# EAGLE schematic astronaut_mainboard (EAGLE 7.5.0)
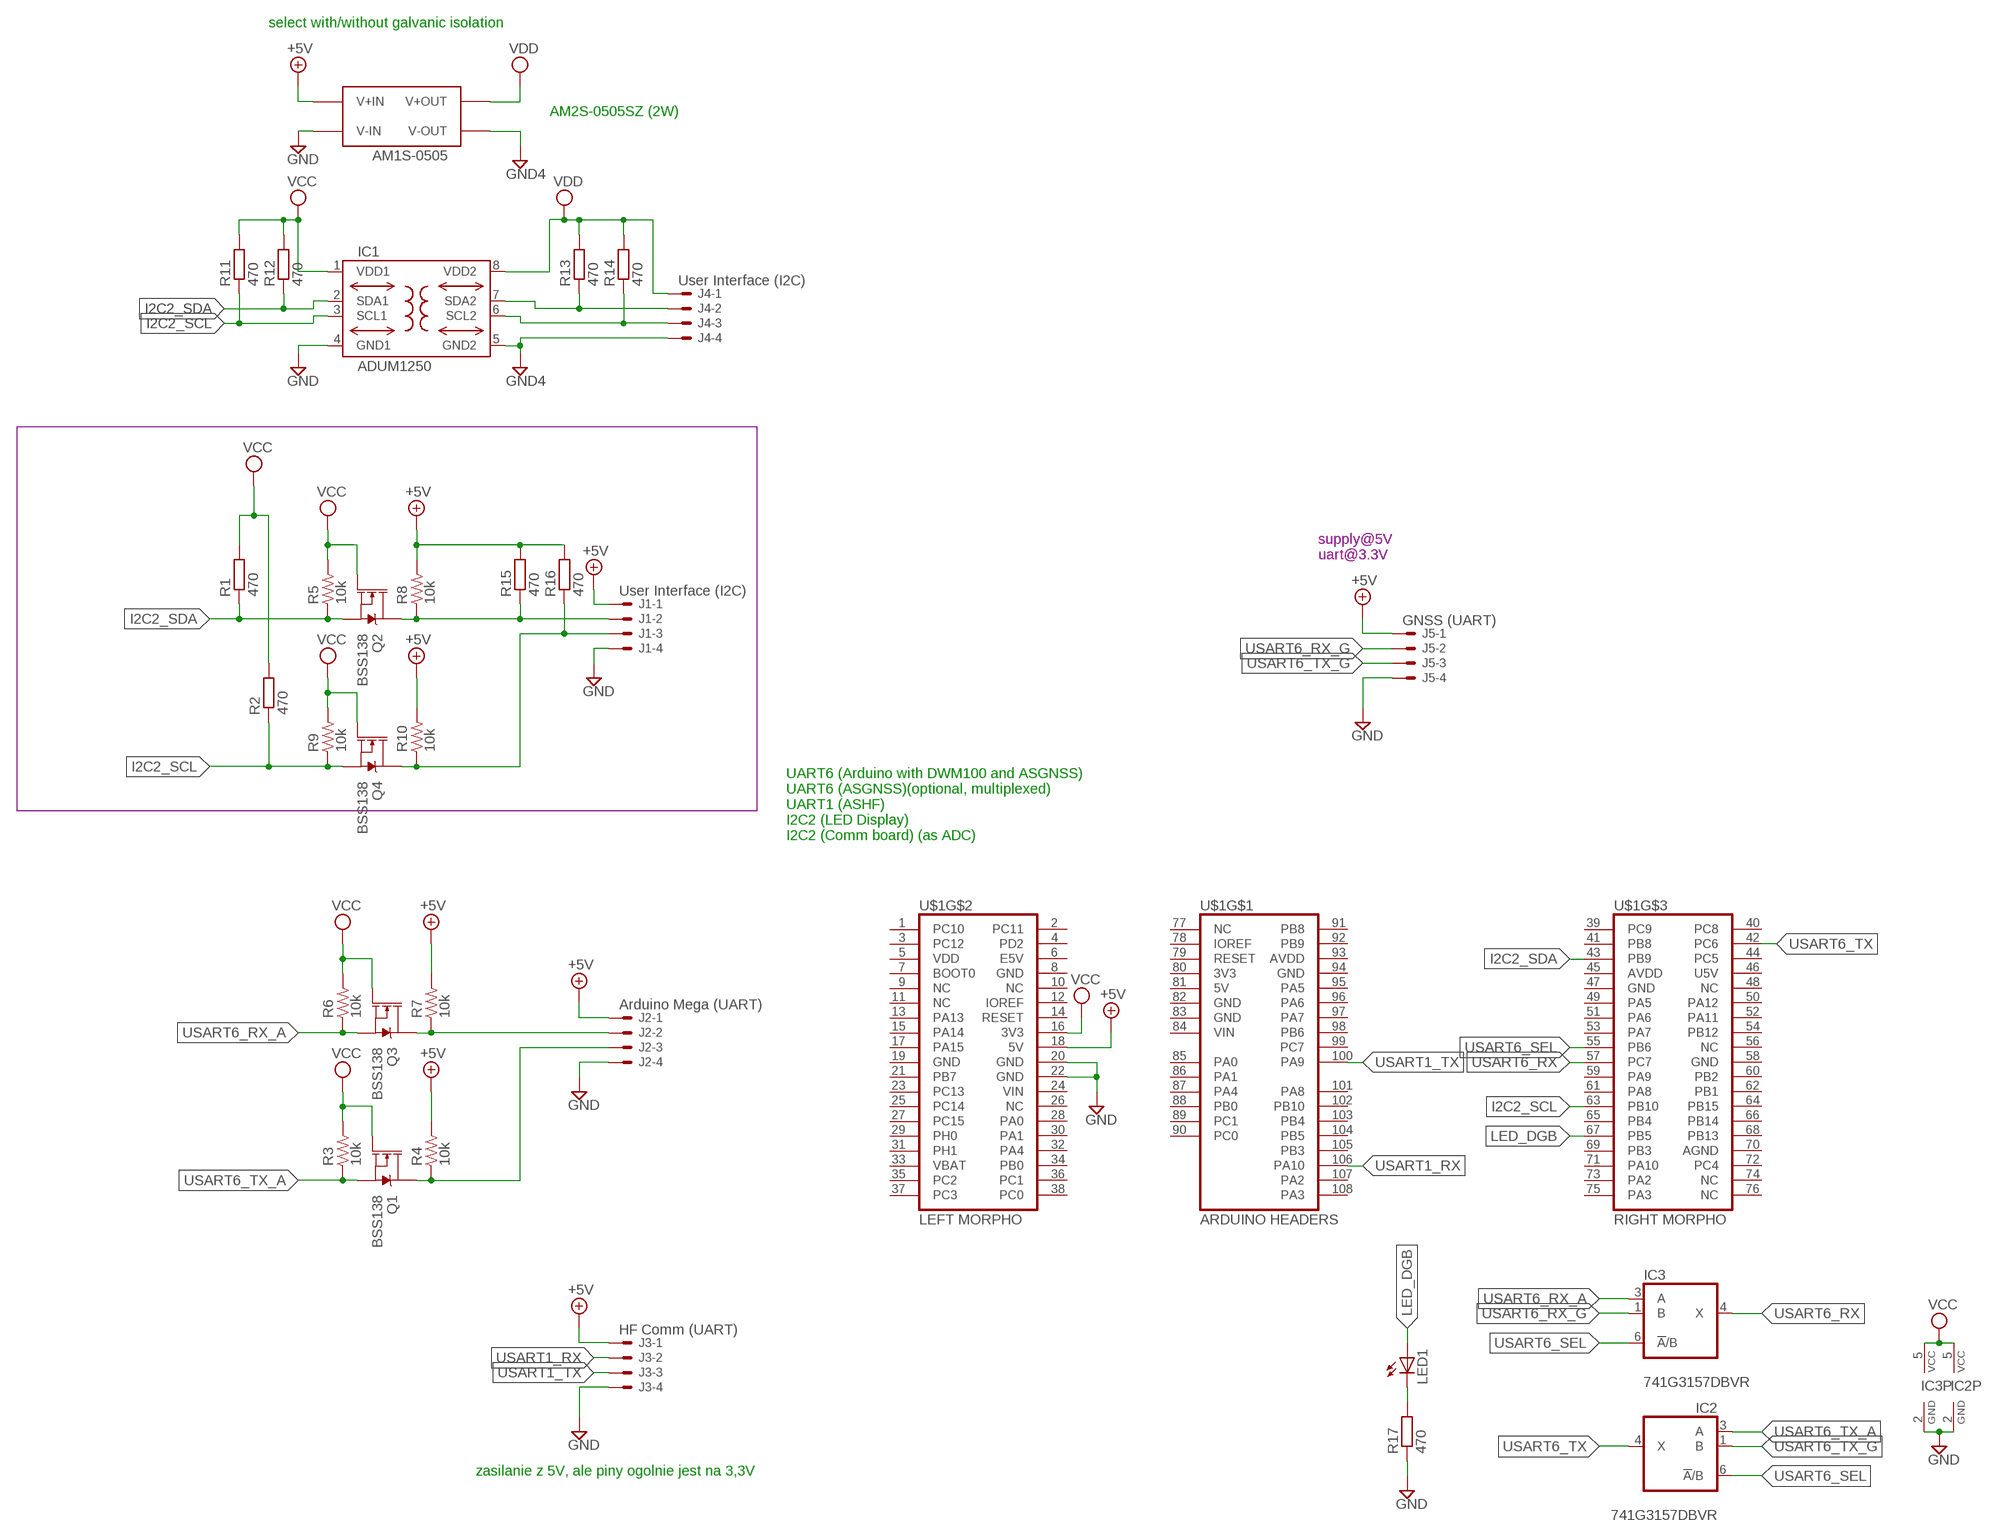
[diagram p0: schematic, sheet 1]

## Parts
IC1  ADUM1250  [SO8-COOL]
IC2  741G3157DBVR  [DBV_R-PDSO-G6]
IC3  741G3157DBVR  [DBV_R-PDSO-G6]
J1  User Interface (I2C)  22-05-7048-04  [7395-04]
J2  Arduino Mega (UART)  22-05-7048-04  [7395-04]
J3  HF Comm (UART)  22-05-7048-04  [7395-04]
J4  User Interface (I2C)  22-05-7048-04  [7395-04]
J5  GNSS (UART)  22-05-7048-04  [7395-04]
LED1  LED3MM  [LED3MM]
Q1  BSS138  MOSFET-NCH-AO3404A  [SOT23-3]
Q2  BSS138  MOSFET-NCH-AO3404A  [SOT23-3]
Q3  BSS138  MOSFET-NCH-AO3404A  [SOT23-3]
Q4  BSS138  MOSFET-NCH-AO3404A  [SOT23-3]
R1  470  R-EU_R0805  [R0805]
R2  470  R-EU_R0805  [R0805]
R3  10k  R_1206  [R1206]
R4  10k  R_1206  [R1206]
R5  10k  R_1206  [R1206]
R6  10k  R_1206  [R1206]
R7  10k  R_1206  [R1206]
R8  10k  R_1206  [R1206]
R9  10k  R_1206  [R1206]
R10  10k  R_1206  [R1206]
R11  470  R-EU_R0805  [R0805]
R12  470  R-EU_R0805  [R0805]
R13  470  R-EU_R0805  [R0805]
R14  470  R-EU_R0805  [R0805]
R15  470  R-EU_R0805  [R0805]
R16  470  R-EU_R0805  [R0805]
R17  470  R-EU_R0805  [R0805]
U$1  NUCLEO_F411RE  [ARDUINO+MORPHO]
U$2  AM1S-0505  [SIP4]

## Nets
+5V: J1.1 J2.1 J3.1 J5.1 R4.2 R7.2 R8.2 R10.2 R15.2 R16.2 U$1.18(5V) U$2.P$2(V+IN)
ARDU_PIN_1: J2.2 Q3.3(D) R7.1
ARDU_PIN_2: J2.3 Q1.3(D) R4.1
ARDU_PIN_3: J1.2 Q2.3(D) R8.1 R15.1
ARDU_PIN_4: J1.3 Q4.3(D) R10.1 R16.1
GND: IC1.4(GND1) IC2.2(GND) IC3.2(GND) J1.4 J2.4 J3.4 J5.4 R17.1 U$1.20(GND) U$1.22(GND) U$2.P$1(V-IN)
GND4: IC1.5(GND2) J4.4 U$2.P$3(V-OUT)
I2C2_SCL: IC1.3(SCL1) Q4.2(S) R2.1 R9.1 R11.1 U$1.63(PB10)
I2C2_SDA: IC1.2(SDA1) Q2.2(S) R1.1 R5.1 R12.1 U$1.43(PB9)
LED_DGB: LED1.A U$1.67(PB5)
N$1: IC1.7(SDA2) J4.2 R13.1
N$3: LED1.K(C) R17.2
N$4: IC1.6(SCL2) J4.3 R14.1
USART1_RX: J3.2 U$1.106(PA10)
USART1_TX: J3.3 U$1.100(PA9)
USART6_RX: IC3.4(X) U$1.57(PC7)
USART6_RX_A: IC3.3(A) Q3.2(S) R6.1
USART6_RX_G: IC3.1(B) J5.2
USART6_SEL: IC2.6(!A!/B) IC3.6(!A!/B) U$1.55(PB6)
USART6_TX: IC2.4(X) U$1.42(PC6)
USART6_TX_A: IC2.3(A) Q1.2(S) R3.1
USART6_TX_G: IC2.1(B) J5.3
VCC: IC1.1(VDD1) IC2.5(VCC) IC3.5(VCC) Q1.1(G) Q2.1(G) Q3.1(G) Q4.1(G) R1.2 R2.2 R3.2 R5.2 R6.2 R9.2 R11.2 R12.2 U$1.16(3V3)
VDD: IC1.8(VDD2) J4.1 R13.2 R14.2 U$2.P$4(V+OUT)
Unconnected: U$1.1(PC10) U$1.2(PC11) U$1.3(PC12) U$1.4(PD2) U$1.6(E5V) U$1.7(BOOT0) U$1.9(NC) U$1.10(NC) U$1.11(NC) U$1.12(IOREF) U$1.13(PA13) U$1.14(RESET) U$1.15(PA14) U$1.17(PA15) U$1.21(PB7) U$1.23(PC13) U$1.25(PC14) U$1.26(NC) U$1.27(PC15) U$1.28(PA0) U$1.29(PH0) U$1.30(PA1) U$1.31(PH1) U$1.32(PA4) U$1.34(PB0) U$1.35(PC2) U$1.36(PC1) U$1.37(PC3) U$1.38(PC0) U$1.39(PC9) U$1.40(PC8) U$1.41(PB8) U$1.44(PC5) U$1.48(NC) U$1.49(PA5) U$1.50(PA12) U$1.51(PA6) U$1.52(PA11) U$1.53(PA7) U$1.54(PB12) U$1.56(NC) U$1.59(PA9) U$1.60(PB2) U$1.61(PA8) U$1.62(PB1) U$1.64(PB15) U$1.65(PB4) U$1.66(PB14) U$1.68(PB13) U$1.69(PB3) U$1.71(PA10) U$1.72(PC4) U$1.73(PA2) U$1.74(NC) U$1.75(PA3) U$1.76(NC) U$1.77(NC) U$1.78(IOREF) U$1.79(RESET) U$1.85(PA0) U$1.86(PA1) U$1.87(PA4) U$1.88(PB0) U$1.89(PC1) U$1.90(PC0) U$1.91(PB8) U$1.92(PB9) U$1.95(PA5) U$1.96(PA6) U$1.97(PA7) U$1.98(PB6) U$1.99(PC7) U$1.101(PA8) U$1.102(PB10) U$1.103(PB4) U$1.104(PB5) U$1.105(PB3) U$1.107(PA2) U$1.108(PA3)

## Notes on the sheet
- select with/without galvanic isolation
- AM2S-0505SZ (2W)
- supply@5V 
  uart@3.3V
- UART6 (Arduino with DWM100 and ASGNSS)
  UART6 (ASGNSS)(optional, multiplexed)
  UART1 (ASHF)
  I2C2 (LED Display)
  I2C2 (Comm board) (as ADC)
- zasilanie z 5V, ale piny ogolnie jest na 3,3V

## Power pins joined to a net without a drawn wire
3V3: U$1.80(3V3)
5V: U$1.81(5V)
AGND: U$1.70(AGND)
AVDD: U$1.45(AVDD) U$1.93(AVDD)
GND: U$1.8(GND) U$1.19(GND) U$1.47(GND) U$1.58(GND) U$1.82(GND) U$1.83(GND) U$1.94(GND)
U5V: U$1.46(U5V)
VBAT: U$1.33(VBAT)
VDD: U$1.5(VDD)
VIN: U$1.24(VIN) U$1.84(VIN)

## Library data of the parts
IC1 = analog-devices-3:ADUM1250: Hot Swappable, Dual I2C Isolators Source: http://www.analog.com/static/imported-files/data_sheets/ADUM1250_1251.pdf
IC2 IC3 = 74xx-little-de:74*1G3157: Single-Pole, Double-Throw Analog Switch Source: http://focus.ti.com/lit/ds/symlink/sn74lvc1g3157.pdf
J1-J5 = EP_molex_6410_7395:22-?-04: CONNECTOR wire to board 2.54 mm (.1 inch) pitch header
LED1 = led:LED: LED OSRAM: - CHIPLED LG R971, LG N971, LY N971, LG Q971, LY Q971, LO R971, LY R971 LH N974, LH R974 LS Q976, LO Q976, LY Q976 LO Q996 - Hyper CHIPLED LW Q18S LB Q993, LB Q99A, LB R99A - SideLED LS A670, LO A670, LY A670, LG A670, LP A670 LB A673, LV A673, LT A673, LW A673 LH A674 LY A675 LS A676, LA A676, LO A676, LY A676, LW A676 LS A679, LY A679, LG A679 - Hyper Micro SIDELED® LS Y876, LA Y876, LO Y876, LY Y876 LT Y87S - SmartLED LW L88C, LW L88S LB L89C, LB L89S, LG L890 LS L89K, LO L89K, LY L89K LS L896, LA L896, LO L896, LY L896 - TOPLED LS T670, LO T670, LY T670, LG T670, LP T670 LSG T670, LSP T670, LSY T670, LOP T670, LYG T670 LG T671, LOG T671, LSG T671 LB T673, LV T673, LT T673, LW T673 LH T674 LS T676, LA T676, LO T676, LY T676, LB T676, LH T676, LSB T676, LW T676 LB T67C, LV T67C, LT T67C, LS T67K, LO T67K, LY T67K, LW E67C LS E67B, LA E67B, LO E67B, LY E67B, LB E67C, LV E67C, LT E67C LW T67C LS T679, LY T679, LG T679 LS T770, LO T770, LY T770, LG T770, LP T770 LB T773, LV T773, LT T773, LW T773 LH T774 LS E675, LA E675, LY E675, LS T675 LS T776, LA T776, LO T776, LY T776, LB T776 LHGB T686 LT T68C, LB T68C - Hyper Mini TOPLED® LB M676 - Mini TOPLED Santana® LG M470 LS M47K, LO M47K, LY M47K Source: http://www.osram.convergy.de LUXEON: - LUMILED® LXK2-PW12-R00, LXK2-PW12-S00, LXK2-PW14-U00, LXK2-PW14-V00 LXK2-PM12-R00, LXK2-PM12-S00, LXK2-PM14-U00 LXK2-PE12-Q00, LXK2-PE12-R00, LXK2-PE12-S00, LXK2-PE14-T00, LXK2-PE14-U00 LXK2-PB12-K00, LXK2-PB12-L00, LXK2-PB12-M00, LXK2-PB14-N00, LXK2-PB14-P00, LXK2-PB14-Q00 LXK2-PR12-L00, LXK2-PR12-M00, LXK2-PR14-Q00, LXK2-PR14-R00 LXK2-PD12-Q00, LXK2-PD12-R00, LXK2-PD12-S00 LXK2-PH12-R00, LXK2-PH12-S00 LXK2-PL12-P00, LXK2-PL12-Q00, LXK2-PL12-R00 Source: www.luxeon.com KINGBRIGHT: KA-3528ASYC Source: www.kingbright.com
Q1-Q4 = SparkFun-DiscreteSemi:MOSFET-NCH: N-channel MOSFETs Voltage controlled devices that allow control of high current outputs. SparkFun Products: SparkFun OpenScale <https://www.sparkfun.com/products/13261> SparkFun Digital Sandbox <https://www.sparkfun.com/products/12651> SparkFun Monster Moto Shield <https://www.sparkfun.com/products/10182> SparkFun MOSFET Power Controller <https://www.sparkfun.com/products/11214>; PROD_ID: TRANS-12988; VALUE: 5.8A/30V/35mΩ
R1 R2 R11-R17 = rcl:R-EU_: RESISTOR, European symbol
R3-R10 = rc-master-smd:R_: RESISTOR
U$1 = stm32_nucleo_shield:NUCLEO_F411RE
U$2 = am1s:AM1S-0505